# EAGLE design h bridge (EAGLE 9.5.2)
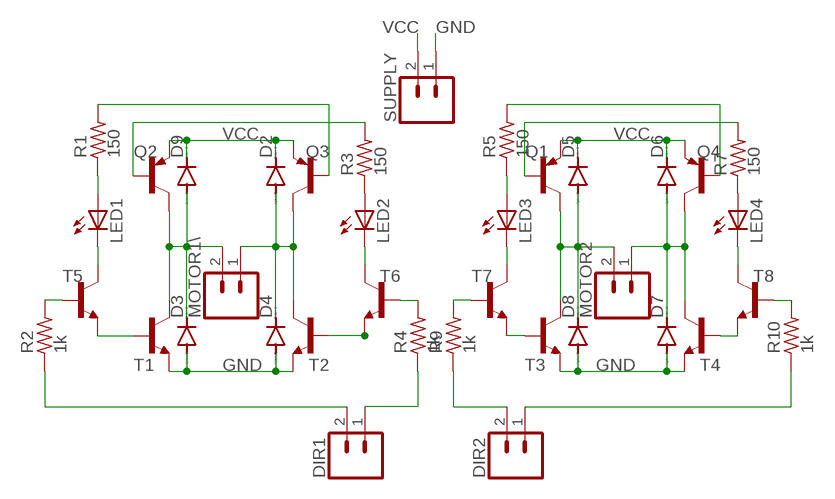
[diagram p0: schematic, sheet 1]

## Parts
D2  DIODE-D-2.5  [D-2.5]
D3  DIODE-D-2.5  [D-2.5]
D4  DIODE-D-2.5  [D-2.5]
D5  DIODE-D-2.5  [D-2.5]
D6  DIODE-D-2.5  [D-2.5]
D7  DIODE-D-2.5  [D-2.5]
D8  DIODE-D-2.5  [D-2.5]
D9  DIODE-D-2.5  [D-2.5]
DIR1  CONN_02  [1X02]
DIR2  CONN_02  [1X02]
LED1  LED3MM  [LED3MM]
LED2  LED3MM  [LED3MM]
LED3  LED3MM  [LED3MM]
LED4  LED3MM  [LED3MM]
MOTOR1\  CONN_02  [1X02]
MOTOR2  CONN_02  [1X02]
Q1  2N2907  [TO92-EBC-OVAL]
Q2  2N2907  [TO92-EBC-OVAL]
Q3  2N2907  [TO92-EBC-OVAL]
Q4  2N2907  [TO92-EBC-OVAL]
R1  150  R-US_0204/7  [0204/7]
R2  1k  R-US_0204/7  [0204/7]
R3  150  R-US_0204/7  [0204/7]
R4  1k  R-US_0204/7  [0204/7]
R5  150  R-US_0204/7  [0204/7]
R7  150  R-US_0204/7  [0204/7]
R9  1k  R-US_0204/7  [0204/7]
R10  1k  R-US_0204/7  [0204/7]
SUPPLY  CONN_02  [1X02]
T1  2N2222  [TO92-EBC-OVAL]
T2  2N2222  [TO92-EBC-OVAL]
T3  2N2222  [TO92-EBC-OVAL]
T4  2N2222  [TO92-EBC-OVAL]
T5  2N2222  [TO92-EBC-OVAL]
T6  2N2222  [TO92-EBC-OVAL]
T7  2N2222  [TO92-EBC-OVAL]
T8  2N2222  [TO92-EBC-OVAL]

## Nets
GND: D3.A D4.A D7.A D8.A SUPPLY.1 T1.E T2.E T3.E T4.E
N$1: T3.B T7.E
N$2: Q3.B R1.2
N$3: Q1.B R7.2
N$4: LED2.A R3.1
N$5: Q2.B R3.2
N$6: Q4.B R5.2
N$7: LED4.A R7.1
N$9: T2.B T6.E
N$10: LED1.A R1.1
N$11: LED1.K(C) T5.C
N$12: R2.2 T5.B
N$13: T4.B T8.E
N$14: R4.2 T6.B
N$15: R9.2 T7.B
N$16: R10.2 T8.B
N$17: DIR1.2 R2.1
N$18: D3.C D9.A MOTOR1\.2 Q2.C T1.C
N$19: D2.A D4.C MOTOR1\.1 Q3.C T2.C
N$20: D5.A D8.C MOTOR2.2 Q1.C T3.C
N$21: D6.A D7.C MOTOR2.1 Q4.C T4.C
N$22: DIR1.1 R4.1
N$23: DIR2.2 R9.1
N$24: DIR2.1 R10.1
N$25: LED2.K(C) T6.C
N$26: LED3.K(C) T7.C
N$27: LED3.A R5.1
N$28: LED4.K(C) T8.C
N$29: T1.B T5.E
VCC: D2.C D5.C D6.C D9.C Q1.E Q2.E Q3.E Q4.E SUPPLY.2

## Library data of the parts
D2-D9 = diode:DIODE-: DIODE
DIR1 DIR2 MOTOR1\ MOTOR2 SUPPLY = SparkFun-Connectors:CONN_02: Multi connection point. Often used as Generic Header-pin footprint for 0.1 inch spaced/style header connections On any of the 0.1 inch spaced packages, you can populate with these: Break Away Headers - Straight <https://www.sparkfun.com/products/116> (PRT-00116) Break Away Male Headers - Right Angle <https://www.sparkfun.com/products/553> (PRT-00553) Female Headers <https://www.sparkfun.com/products/115> (PRT-00115) Break Away Headers - Machine Pin <https://www.sparkfun.com/products/117> (PRT-00117) Break Away Female Headers - Swiss Machine Pin <https://www.sparkfun.com/products/743> (PRT-00743) For SCREWTERMINALS and SPRING TERMINALS visit here: Screw Terimnals on SparkFun.com <https://www.sparkfun.com/search/results?term=Screw+Terminals> (5mm/3.5mm/2.54mm spacing) This device is also useful as a general connection point to wire up your design to another part of your project. Our various solder wires solder well into these plated through hole pads. Hook-Up Wire - Assortment (Stranded, 22 AWG) <https://www.sparkfun.com/products/11375> (PRT-11375) Hook-Up Wire - Assortment (Solid Core, 22 AWG) <https://www.sparkfun.com/products/11367> (PRT-11367) View the entire wire category on our website here <https://www.sparkfun.com/categories/141> Special notes: Molex polarized connector foot print use with: PRT-08233 with associated crimp pins and housings. 2.54_SCREWTERM for use with PRT-10571. 3.5mm Screw Terminal footprints for PRT-08084 5mm Screw Terminal footprints for use with PRT-08432
LED1-LED4 = adafruit:LED: LED OSRAM: - CHIPLED LG R971, LG N971, LY N971, LG Q971, LY Q971, LO R971, LY R971 LH N974, LH R974 LS Q976, LO Q976, LY Q976 LO Q996 - Hyper CHIPLED LW Q18S LB Q993, LB Q99A, LB R99A - SideLED LS A670, LO A670, LY A670, LG A670, LP A670 LB A673, LV A673, LT A673, LW A673 LH A674 LY A675 LS A676, LA A676, LO A676, LY A676, LW A676 LS A679, LY A679, LG A679 - Hyper Micro SIDELED® LS Y876, LA Y876, LO Y876, LY Y876 LT Y87S - SmartLED LW L88C, LW L88S LB L89C, LB L89S, LG L890 LS L89K, LO L89K, LY L89K LS L896, LA L896, LO L896, LY L896 - TOPLED LS T670, LO T670, LY T670, LG T670, LP T670 LSG T670, LSP T670, LSY T670, LOP T670, LYG T670 LG T671, LOG T671, LSG T671 LB T673, LV T673, LT T673, LW T673 LH T674 LS T676, LA T676, LO T676, LY T676, LB T676, LH T676, LSB T676, LW T676 LB T67C, LV T67C, LT T67C, LS T67K, LO T67K, LY T67K, LW E67C LS E67B, LA E67B, LO E67B, LY E67B, LB E67C, LV E67C, LT E67C LW T67C LS T679, LY T679, LG T679 LS T770, LO T770, LY T770, LG T770, LP T770 LB T773, LV T773, LT T773, LW T773 LH T774 LS E675, LA E675, LY E675, LS T675 LS T776, LA T776, LO T776, LY T776, LB T776 LHGB T686 LT T68C, LB T68C - Hyper Mini TOPLED® LB M676 - Mini TOPLED Santana® LG M470 LS M47K, LO M47K, LY M47K Source: http://www.osram.convergy.de/
Q1-Q4 = adafruit:2N2907*: PNP Transistor Big Oval pads
R1-R5 R7 R9 R10 = adafruit:R-US_: RESISTOR, American symbol
T1-T8 = adafruit:2N2222: NPN TRANSISTOR Big oval pads

## Board
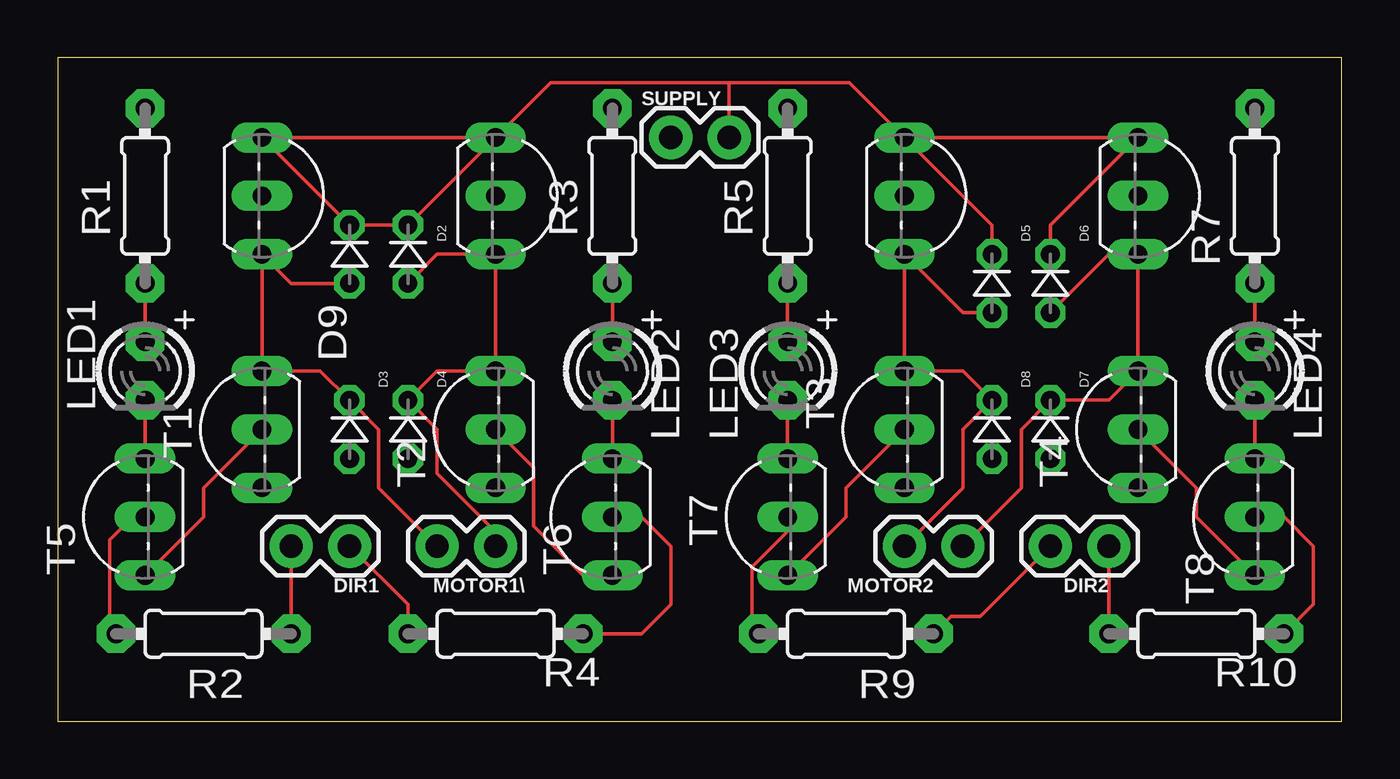
[diagram p1: board, top side]
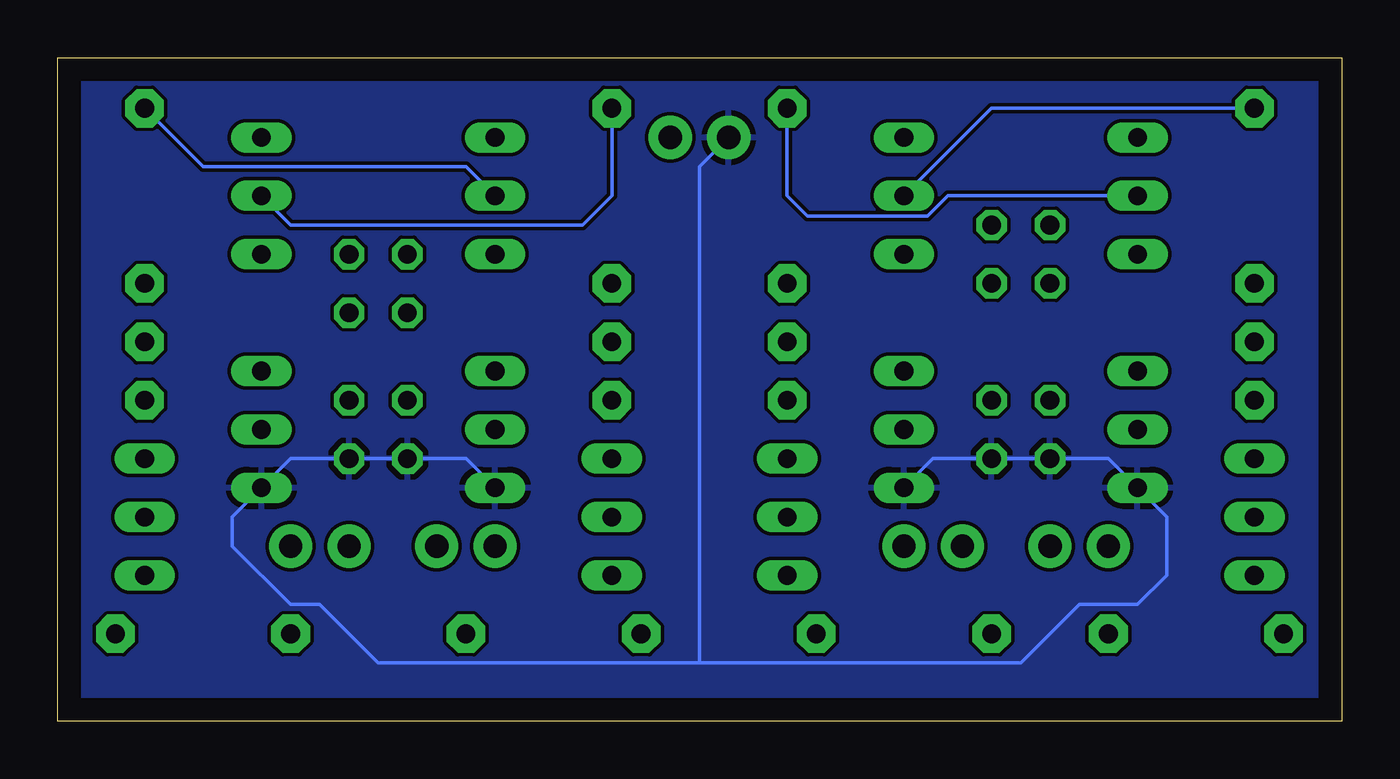
[diagram p2: board, bottom side, seen from below]

Size 55.86 x 28.88 mm. Coordinates in mm from the lower left corner, seen from the top.
Outline: 0,0 55.86,0 55.86,28.88 0,28.88 0,0
Copper layers (1*16): Top 0.035mm / dielectric 1.5mm / Bottom 0.035mm
Design rules "default": minimum track width 6mil, minimum drill 0.35mm, track to track 6mil, track to pad 6mil, pad to pad 6mil, via to via 6mil, smd to smd 6mil, copper to edge 40mil, drill to drill 6mil, minimum pad ring 10mil, minimum via ring 8mil, stop-mask expansion 4mil, vias tented up to drill 0mil, thermal gap 10mil

### Footprints (pad centres in the part's own frame; a part is rotated, then mirrored left to right if it is on the bottom)
D-2.5 = drill 0.813 octagon: A 1.27,0; C -1.27,0
1X02 = drill 1.016 pad 1.88: 1 0,0; 2 2.54,0
LED3MM = drill 0.813 pad 1.676 octagon: A -1.27,0; K 1.27,0
TO92-EBC-OVAL = drill 0.813 long: B 0,-1.27; C 2.54,-1.27; E -2.54,-1.27
0204/7 = drill 0.813 pad 1.676 octagon: 1 -3.81,0; 2 3.81,0

### Placement (x,y rotation side)
D2  15.24,20.32 270 top
D3  12.7,12.7 270 top
D4  15.24,12.7 270 top
D5  40.64,19.05 270 top
D6  43.18,19.05 270 top
D7  43.18,12.7 270 top
D8  40.64,12.7 270 top
D9  12.7,20.32 270 top
DIR1  12.7,7.62 180 top
DIR2  45.72,7.62 180 top
LED1  3.81,15.24 270 top
LED2  24.13,15.24 270 top
LED3  31.75,15.24 270 top
LED4  52.07,15.24 270 top
MOTOR1\  19.05,7.62 180 top
MOTOR2  39.37,7.62 180 top
Q1  38.1,22.86 270 top
Q2  10.16,22.86 270 top
Q3  20.32,22.86 270 top
Q4  48.26,22.86 270 top
R1  3.81,22.86 90 top
R2  6.35,3.81 180 top
R3  24.13,22.86 90 top
R4  19.05,3.81 0 top
R5  31.75,22.86 90 top
R7  52.07,22.86 90 top
R9  34.29,3.81 180 top
R10  49.53,3.81 0 top
SUPPLY  26.67,25.4 0 top
T1  7.62,12.7 90 top
T2  17.78,12.7 90 top
T3  35.56,12.7 90 top
T4  45.72,12.7 90 top
T5  2.54,8.89 90 top
T6  22.86,8.89 90 top
T7  30.48,8.89 90 top
T8  50.8,8.89 90 top

### Tracks (layer width: path | path; a pad name or v marks a point on that pad's centre or on a via)
GND
  Bottom 0.152: SUPPLY.1 27.94,24.13 27.94,2.54 | 27.94,2.54 13.97,2.54 11.43,5.08 8.89,5.08 7.62,6.35 7.62,8.89 T1.E 10.16,11.43 D3.A D4.A 17.78,11.43 T2.E | T3.E 38.1,11.43 D8.A D7.A 45.72,11.43 T4.E 48.26,8.89 48.26,7.62 45.72,5.08 44.45,5.08 41.91,2.54 27.94,2.54
  pour Bottom: -1.27,29.21 57.15,29.21 57.15,-1.27 -1.27,-1.27
N$1
  Top 0.152: T3.B 34.29,10.16 34.29,8.89 T7.E
N$2
  Bottom 0.152: Q3.B 15.24,26.67 R1.2
N$3
  Bottom 0.152: R7.2 49.53,24.13 38.1,24.13 Q1.B
N$4
  Top 0.152: R3.1 LED2.A
N$5
  Bottom 0.152: Q2.B 17.13,22.86 18.02,21.97 23.24,21.97 24.13,22.86 R3.2
N$6
  Bottom 0.152: Q4.B 45.72,21.59 33.02,21.59 31.75,22.86 R5.2
N$7
  Top 0.152: R7.1 LED4.A
N$9
  Top 0.152: T2.B 20.7,11.05 20.7,8.51 22.86,6.35 T6.E
N$10
  Top 0.152: R1.1 LED1.A
N$11
  Top 0.152: LED1.K T5.C
N$12
  Top 0.152: T5.B 3.25,8.89 2.26,7.9 2.26,4.09 R2.2
N$13
  Top 0.152: T4.B 49.53,10.16 49.53,8.89 T8.E
N$14
  Top 0.152: R4.2 25.4,3.81 26.67,5.08 26.67,7.62 25.4,8.89 T6.B
N$15
  Top 0.152: T7.B 31.75,8.27 30.2,6.72 30.2,4.09 R9.2
N$16
  Top 0.152: R10.2 54.61,5.08 54.61,7.62 53.34,8.89 T8.B
N$17
  Top 0.152: DIR1.2 R2.1
N$18
  Top 0.152: D9.A 10.16,19.05 Q2.C T1.C 11.43,15.24 D3.C 13.97,12.7 13.97,10.16 MOTOR1\.2
N$19
  Top 0.152: D2.A 16.51,20.32 Q3.C T2.C 16.51,15.24 D4.C 16.51,12.7 16.51,10.78 19.05,8.24 MOTOR1\.1
N$20
  Top 0.152: D5.A 39.37,17.78 Q1.C T3.C 39.37,15.24 D8.C 39.37,12.7 39.37,10.16 MOTOR2.2
N$21
  Top 0.152: MOTOR2.1 41.91,10.16 41.91,12.7 D7.C 45.72,13.97 T4.C Q4.C 45.72,20.32 D6.A
N$22
  Top 0.152: R4.1 15.24,5.08 DIR1.1
N$23
  Top 0.152: DIR2.2 40.13,4.57 38.86,4.57 R9.1
N$24
  Top 0.152: DIR2.1 R10.1
N$25
  Top 0.152: LED2.K T6.C
N$26
  Top 0.152: T7.C LED3.K
N$27
  Top 0.152: R5.1 LED3.A
N$28
  Top 0.152: LED4.K T8.C
N$29
  Top 0.152: T1.B 6.35,10.16 6.35,8.89 T5.E
VCC
  Top 0.152: Q3.E Q2.E D9.C D2.C Q3.E | Q1.E Q4.E 43.18,21.59 D6.C | D5.C 40.64,21.59 Q1.E | SUPPLY.2 29.21,27.79 | Q1.E 34.44,27.79 29.21,27.79 | Q3.E 21.44,27.79 29.21,27.79